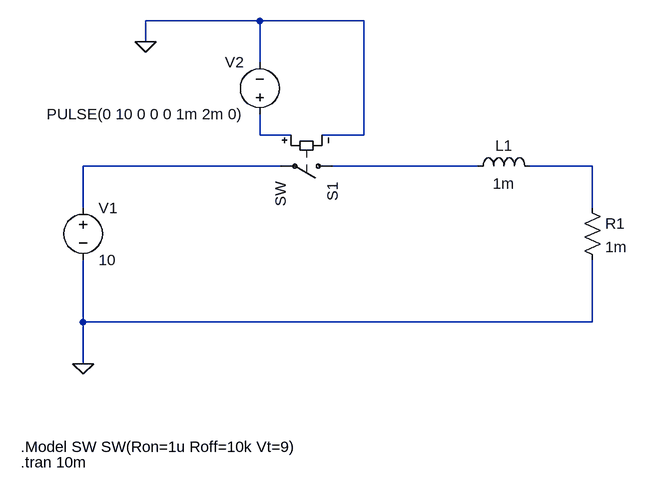
[diagram p0: schematic inductance_v2.asc]
inductance_v2.asc, the LTspice schematic file:
Version 4.1
SHEET 1 880 680
WIRE 224 -144 48 -144
WIRE 384 -144 224 -144
WIRE 48 -112 48 -144
WIRE 224 -80 224 -144
WIRE 224 32 224 0
WIRE 272 32 224 32
WIRE 384 32 384 -144
WIRE 384 32 320 32
WIRE 256 80 -48 80
WIRE 560 80 336 80
WIRE 736 80 640 80
WIRE -48 144 -48 80
WIRE 736 144 736 80
WIRE -48 320 -48 224
WIRE 736 320 736 224
WIRE 736 320 -48 320
WIRE -48 384 -48 320
FLAG 48 -112 0
FLAG -48 384 0
SYMBOL voltage 224 16 R180
WINDOW 0 24 96 Left 2
WINDOW 3 24 16 Left 2
WINDOW 123 0 0 Left 0
WINDOW 39 0 0 Left 0
SYMATTR InstName V2
SYMATTR Value PULSE(0 10 0 0 0 1m 2m 0)
SYMBOL res 720 128 R0
SYMATTR InstName R1
SYMATTR Value 1m
SYMBOL sw 352 80 R90
SYMATTR InstName S1
SYMBOL ind 544 96 R270
WINDOW 0 32 56 VTop 2
WINDOW 3 5 56 VBottom 2
SYMATTR InstName L1
SYMATTR Value 1m
SYMBOL voltage -48 128 R0
WINDOW 123 0 0 Left 0
WINDOW 39 0 0 Left 0
SYMATTR InstName V1
SYMATTR Value 10
TEXT -144 512 Left 2 !.Model SW SW(Ron=1u Roff=10k Vt=9)
TEXT -144 536 Left 2 !.tran 10m

The netlist it stands for:
* inductance_v2.asc
V2 N001 0 PULSE(0 10 0 0 0 1m 2m 0)
R1 N004 0 1m
S1 N003 N002 N001 0 SW
L1 N003 N004 1m
V1 N002 0 10
.Model SW SW(Ron=1u Roff=10k Vt=9)
.tran 10m
.backanno
.end